# Altium schematic sheet MainSheet.SchDoc: z80 Single Board Computer: Base
size A4; Author: Naoki Pross; DrawnBy: Naoki Pross; Organization: SAM Bellinzona; DocumentNumber: 1; Revision: 1; SheetNumber: 1; SheetTotal: 4; ProjectName: z80uPC
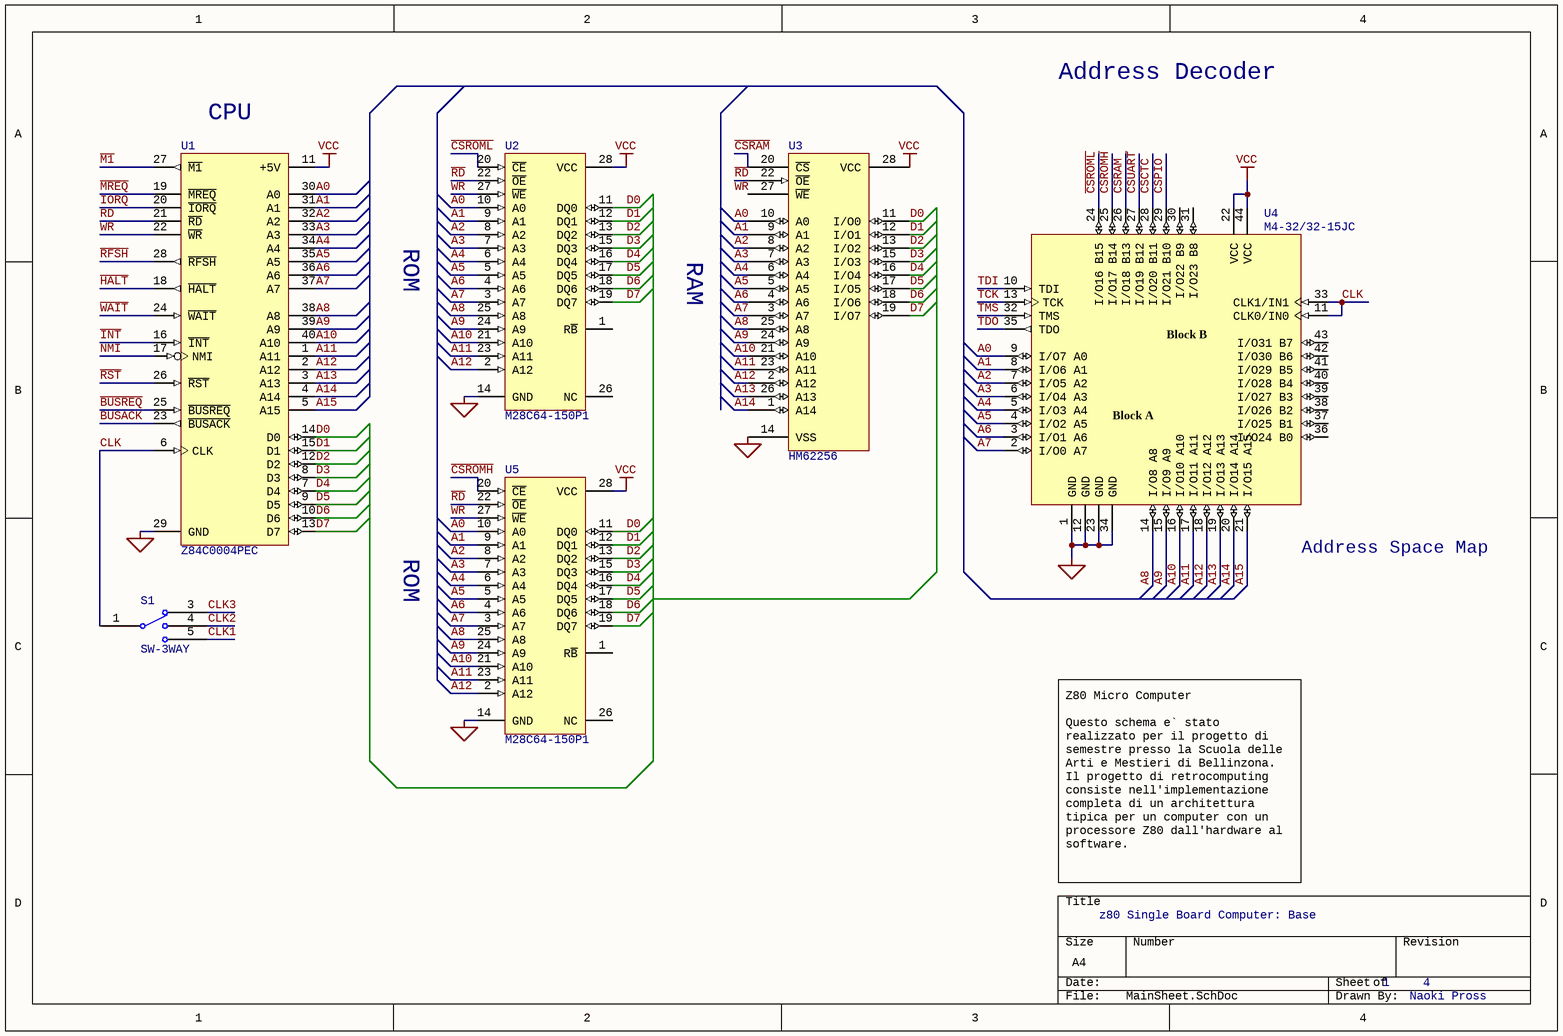
[diagram p0: MainSheet.SchDoc]

## Parts
S1  SW-3WAY
U1  Z84C0004PEC  [PDIP40]
U2  M28C64-150P1  [PDIP28]
U3  HM62256  [PDIP28]
U4  M4-32/32-15JC  [PLCC44_N]
U5  M28C64-150P1  [PDIP28]

## Nets
GND: U1.29(GND) U2.14(GND) U3.14(VSS) U4.1(GND) U4.12(GND) U4.23(GND) U4.34(GND) U5.14(GND)
VCC: U1.11(+5V) U2.28(VCC) U3.28(VCC) U4.22(VCC) U4.44(VCC) U5.28(VCC)
A0: U1.30(A0) U2.10(A0) U3.10(A0) U4.9(I/O7_A0) U5.10(A0)
A1: U1.31(A1) U2.9(A1) U3.9(A1) U4.8(I/O6_A1) U5.9(A1)
A2: U1.32(A2) U2.8(A2) U3.8(A2) U4.7(I/O5_A2) U5.8(A2)
A3: U1.33(A3) U2.7(A3) U3.7(A3) U4.6(I/O4_A3) U5.7(A3)
A4: U1.34(A4) U2.6(A4) U3.6(A4) U4.5(I/O3_A4) U5.6(A4)
A5: U1.35(A5) U2.5(A5) U3.5(A5) U4.4(I/O2_A5) U5.5(A5)
A6: U1.36(A6) U2.4(A6) U3.4(A6) U4.3(I/O1_A6) U5.4(A6)
A7: U1.37(A7) U2.3(A7) U3.3(A7) U4.2(I/O0_A7) U5.3(A7)
A8: U1.38(A8) U2.25(A8) U3.25(A8) U4.14(I/O8_A8) U5.25(A8)
A9: U1.39(A9) U2.24(A9) U3.24(A9) U4.15(I/O9_A9) U5.24(A9)
A10: U1.40(A10) U2.21(A10) U3.21(A10) U4.16(I/O10_A10) U5.21(A10)
A11: U1.1(A11) U2.23(A11) U3.23(A11) U4.17(I/O11_A11) U5.23(A11)
A12: U1.2(A12) U2.2(A12) U3.2(A12) U4.18(I/O12_A12) U5.2(A12)
A13: U1.3(A13) U3.26(A13) U4.19(I/O13_A13)
A14: U1.4(A14) U3.1(A14) U4.20(I/O14_A14)
A15: U1.5(A15) U4.21(I/O15_A15)
~{BUSACK}: U1.23(~{BUSACK})
~{BUSREQ}: U1.25(~{BUSREQ})
~{CSCTC}: U4.28(I/O20_B11)
~{CSPIO}: U4.29(I/O21_B10)
~{CSRAM}: U3.20(~{CS}) U4.26(I/O18_B13)
~{CSROMH}: U4.25(I/O17_B14) U5.20(~{CE})
~{CSROML}: U2.20(~{CE}) U4.24(I/O16_B15)
~{CSUART}: U4.27(I/O19_B12)
CLK: U1.6(CLK) U4.11(CLK0/IN0) U4.33(CLK1/IN1)
D0: U1.14(D0) U2.11(DQ0) U3.11(I/O0) U5.11(DQ0)
D1: U1.15(D1) U2.12(DQ1) U3.12(I/O1) U5.12(DQ1)
D2: U1.12(D2) U2.13(DQ2) U3.13(I/O2) U5.13(DQ2)
D3: U1.8(D3) U2.15(DQ3) U3.15(I/O3) U5.15(DQ3)
D4: U1.7(D4) U2.16(DQ4) U3.16(I/O4) U5.16(DQ4)
D5: U1.9(D5) U2.17(DQ5) U3.17(I/O5) U5.17(DQ5)
D6: U1.10(D6) U2.18(DQ6) U3.18(I/O6) U5.18(DQ6)
D7: U1.13(D7) U2.19(DQ7) U3.19(I/O7) U5.19(DQ7)
~{HALT}: U1.18(~{HALT})
~{INT}: U1.16(~{INT})
~{IORQ}: U1.20(~{IORQ})
~{M1}: U1.27(~{M1})
~{MREQ}: U1.19(~{MREQ})
NMI: U1.17(NMI)
~{RD}: U1.21(~{RD}) U2.22(~{OE}) U3.22(~{OE}) U5.22(~{OE})
~{RFSH}: U1.28(~{RFSH})
~{RST}: U1.26(~{RST})
TCK: U4.13(TCK)
TDI: U4.10(TDI)
TDO: U4.35(TDO)
TMS: U4.32(TMS)
~{WAIT}: U1.24(~{WAIT})
~{WR}: U1.22(~{WR}) U2.27(~{WE}) U5.27(~{WE})

Not connected (* = marked no-connect by the designer): S1 1 3 4 5; U2 1(R~{B}) 26(NC); U3 27(~{WE}); U4 30(I/O22_B9) 31(I/O23_B8) 36(I/O24_B0) 37(I/O25_B1) 38(I/O26_B2) 39(I/O27_B3) 40(I/O28_B4) 41(I/O29_B5) 42(I/O30_B6) 43(I/O31_B7); U5 1(R~{B}) 26(NC)

## Notes on the sheet
- Address Decoder
- (near U1) CPU
- ROM
- RAM
- (near U4) Address Space Map
- Z80 Micro Computer
  Questo schema e` stato realizzato per il progetto di semestre presso la Scuola delle Arti e Mestieri di Bellinzona. Il progetto di retrocomputing consiste nell'implementazione completa di un architettura tipica per un computer con un processore Z80 dall'hardware al software.
- Labels drawn without touching a wire or pin: ~{WR}
- (in symbol M4-32/32-15JC) Block B; Block A

## Library data of the parts
S1 = SW-3WAY: SGA-13P-03V-7295
U1 = Z84C0004PEC: CMOS 8-Bit Microprocessor; Published: 15-Apr-2002; LatestRevisionDate: 04-Mar-2005; LatestRevisionNote: Stylized 3D Model Added.; DatasheetVersion: Jan-1989; PackageVersion: Jun-1999; PackageReference: PDIP40; Publisher: Altium Limited; PackageDescription: DIP; 40 Leads; Row Spacing 15.24 mm; Pitch 2.54 mm; ComponentLink1Description: Manufacturer Link; ComponentLink1URL: http://www.zilog.com/
U2 U5 = M28C64-150P1: Parallel 64 Kbit (8K x 8) EEPROM with Software Data Protection; Published: 24-Aug-2001; LatestRevisionDate: 06-Jun-2005; LatestRevisionNote: Stylized 3D Model Added.; DatasheetVersion: Jun-1996; PackageVersion: Jan-2003; PackageReference: PDIP28; Publisher: Altium Limited; PackageDescription: DIP; 28 Leads; Row Spacing 15.24 mm; Pitch 2.54 mm; ComponentLink1Description: Manufacturer Link; ComponentLink1URL: http://www.st.com/
U3 = HM62256: 8K x 8 Static RAM
U4 = M4-32/32-15JC: High-Performance EE CMOS In-System Programmable Logic; Published: 23-Sep-2002; LatestRevisionDate: 13-Apr-2006; LatestRevisionNote: IPC-7351 Footprint Added.; DatasheetVersion: Mar-2000; PackageVersion: pkg_32, Aug-2005; PackageReference: PLCC44; Publisher: Altium Limited; PackageDescription: 44-Pin Leaded Chip Carrier 1.27 mm Pitch; Code_IPC: PLCC-44; ComponentLink1Description: Manufacturer Link; ComponentLink1URL: http://www.latticesemi.com/products/mature/index.cfm; ComponentLink2Description: Datasheet; ComponentLink2URL: http://www.latticesemi.com/lit/docs/datasheets/cpld/mach4.pdf